# EasyEDA schematic RC_Car_Project_Slave.json
TITLE: RC Car Project SLAVE; REV: 1.0; Date: 2022-10-08; Sheet: 1/1; Drawn By: Hugo MATHIEU; Company: BUT R&T, Aix-Marseille Université
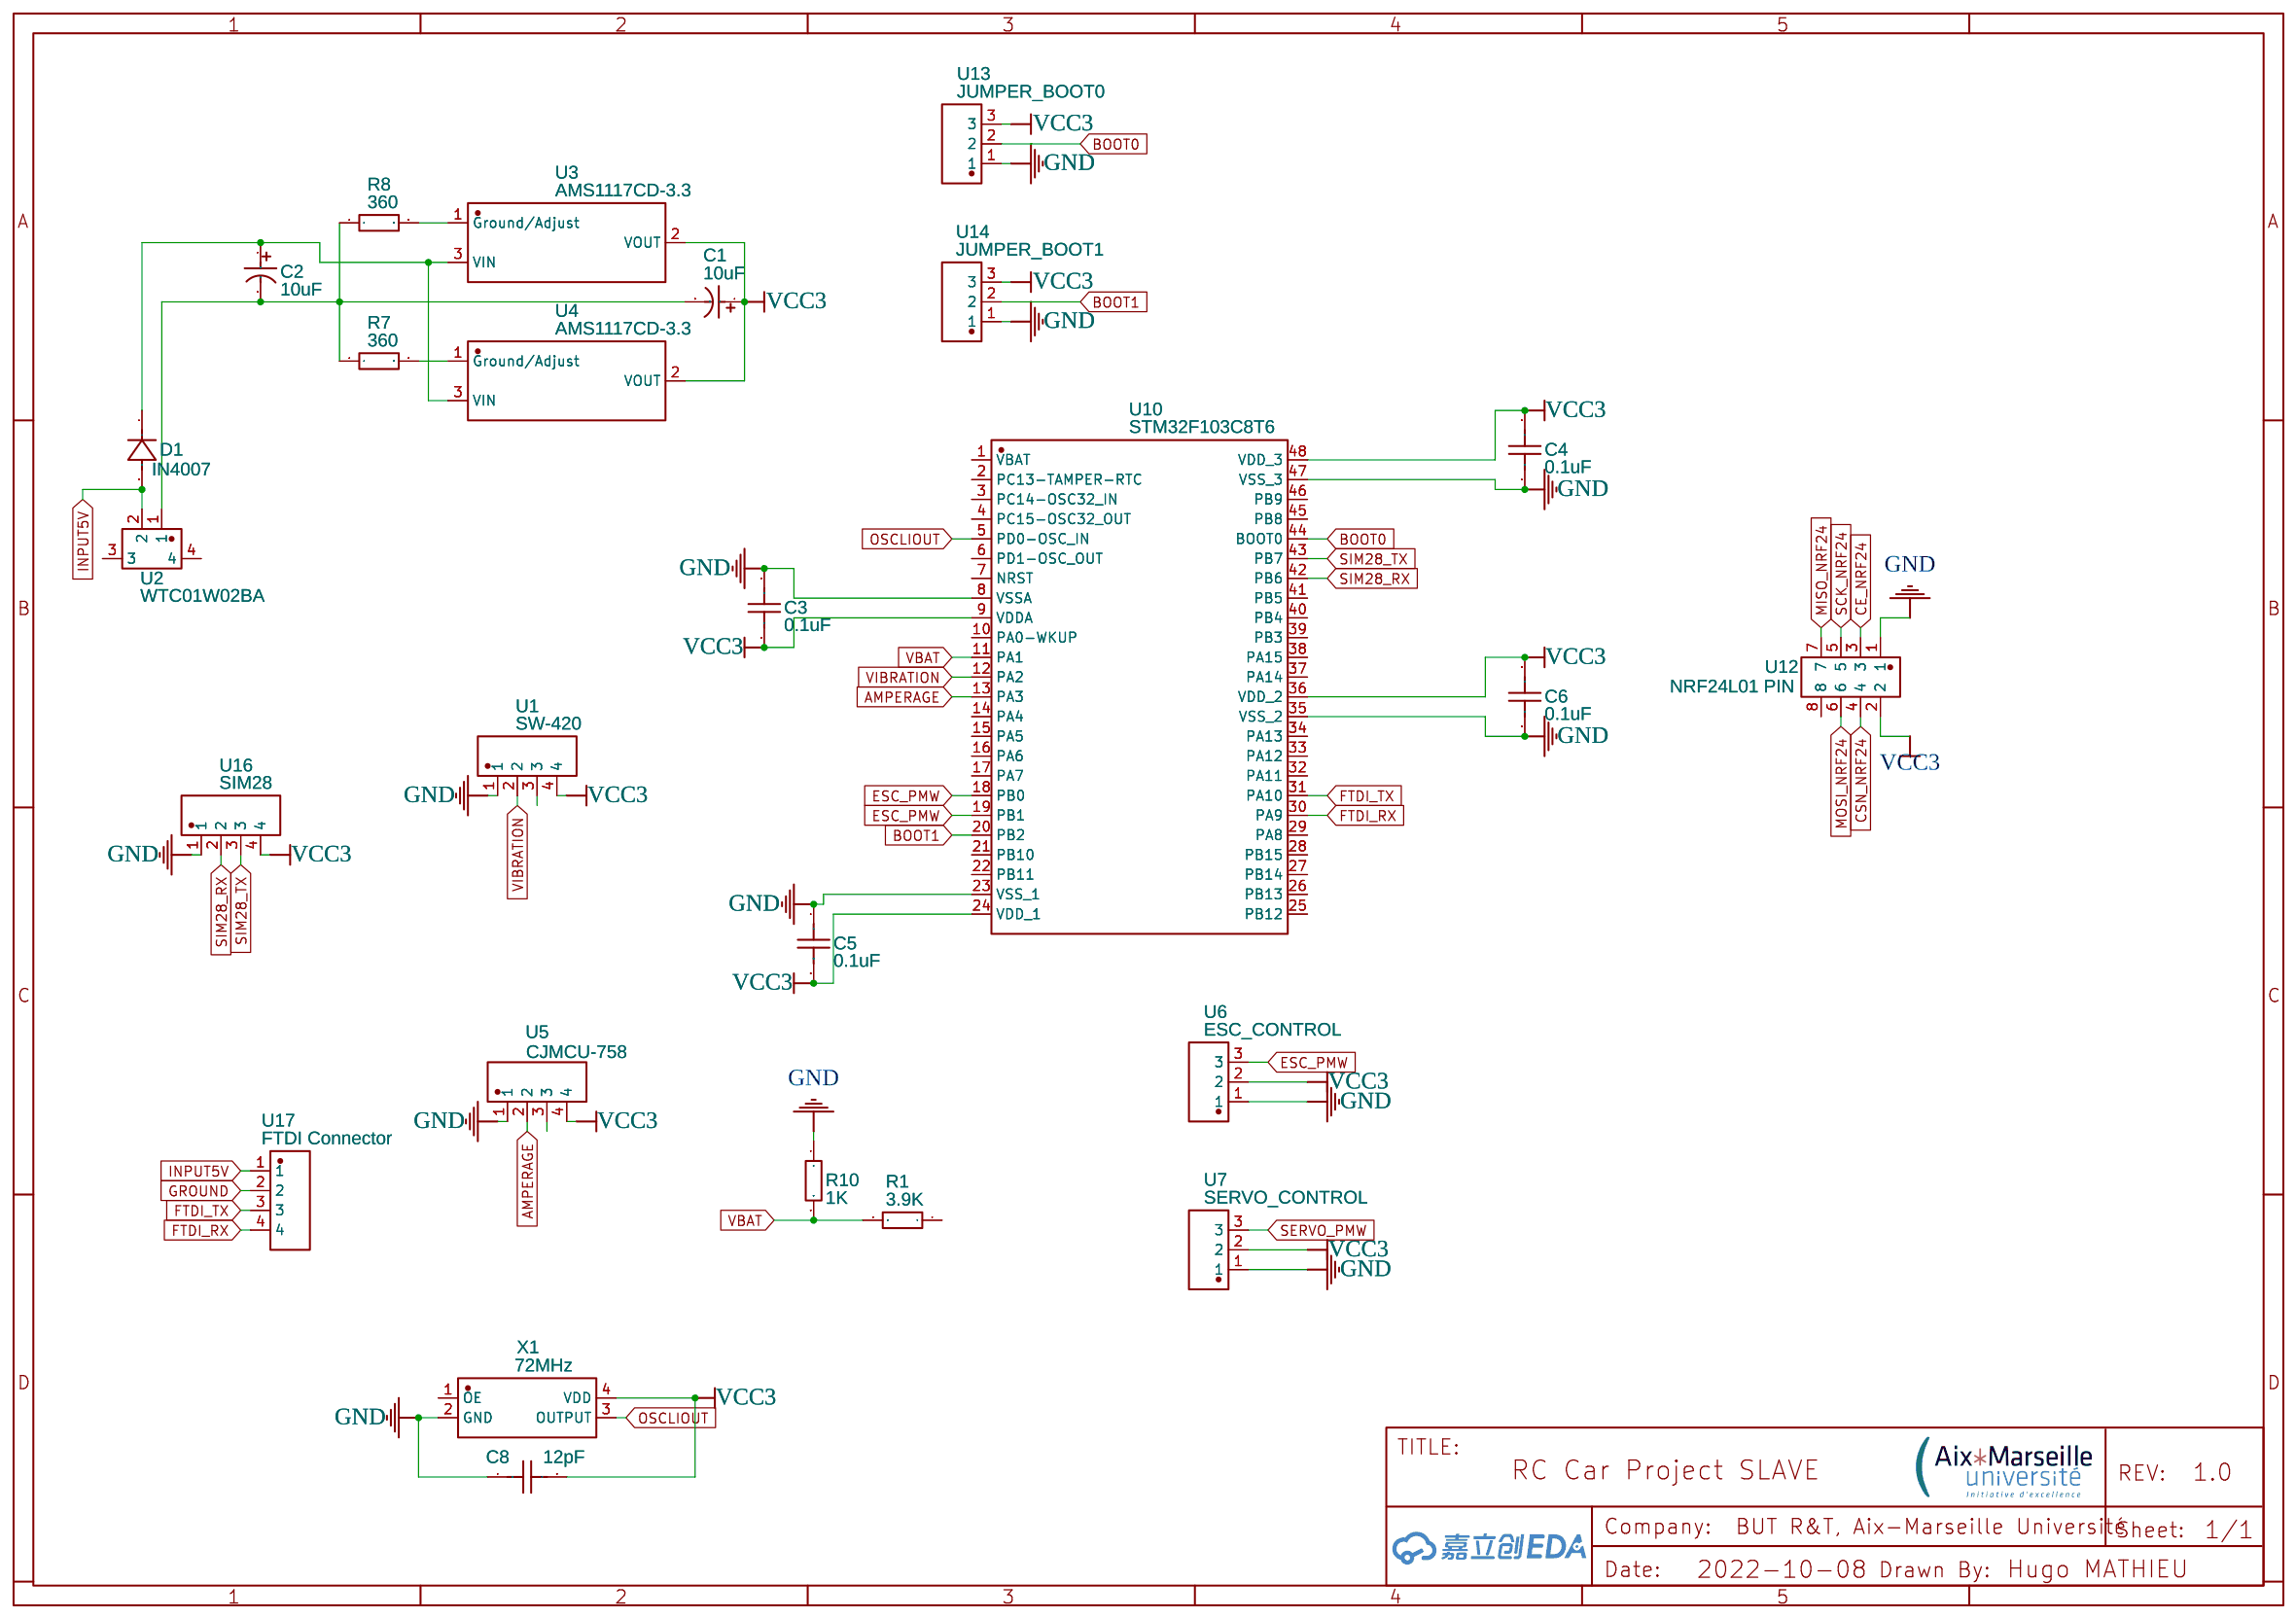
[diagram p0: schematic sheet]

## Parts
C1  10uF  [CAP-SMD_BD5.0-L5.3-W5.3-FD]
C2  10uF  [CAP-SMD_BD5.0-L5.3-W5.3-FD]
C3  0.1uF  [C0805]
C4  0.1uF  [C0805]
C5  0.1uF  [C0805]
C6  0.1uF  [C0805]
C8  12pF  [C0805]
D1  IN4007  [SMA_L4.3-W2.6-LS5.1-RD]
R1  3.9K  [R0805]
R7  360  [R0805]
R8  360  [R0805]
R10  1K  [R0805]
U1  SW-420  [HDR-TH_4P-P2.54-V-M-1]
U2  WTC01W02BA  [CONN-SMD_2P-P1.25_BZCN_WTC01W02BA]
U3  AMS1117CD-3.3  [TO-252-2_L6.6-W6.1-P4.57-LS9.9-BR-CW]
U4  AMS1117CD-3.3  [TO-252-2_L6.6-W6.1-P4.57-LS9.9-BR-CW]
U5  CJMCU-758  [HDR-TH_4P-P2.54-V-M-1]
U6  ESC_CONTROL  [HDR-TH_3P-P2.54-V-M-1]
U7  SERVO_CONTROL  [HDR-TH_3P-P2.54-V-M-1]
U10  STM32F103C8T6  [LQFP-48_L7.0-W7.0-P0.50-LS9.0-BL]
U12  NRF24L01 PIN  [HDR-TH_8P-P2.54-V-F-R2-C4-S2.54]
U13  JUMPER_BOOT0  [HDR-TH_3P-P2.54-V-M-1]
U14  JUMPER_BOOT1  [HDR-TH_3P-P2.54-V-M-1]
U16  SIM28  [HDR-TH_4P-P2.54-V-M-1]
U17  FTDI Connector  [HDR-TH_4P-P2.54-V-M-1]
X1  72MHz  [OSC-SMD_4P-L5.0-W3.2-BL_SG5032]

## Library data of the parts
C1 C2 = RVT1H100M0505: Supplier: LCSC; Manufacturer: ROQANG; Supplier Part: C72487; JLCPCB Part Class: Extended Part
C3-C6 C8 = AC0805JRNPO9BN220: Supplier: LCSC; Supplier Part: C149614; Manufacturer: YAGEO; Contributor: LCSC; JLCPCB Part Class: Extended Part
D1 = IN4007: Supplier: LCSC; Supplier Part: C9900004719; JLCPCB Part Class: Extended Part; Contributor: LCSC
R1 R7 R8 R10 = RC0805FR-07100RL: Supplier: LCSC; Manufacturer: YAGEO; Supplier Part: C105577; JLCPCB Part Class: Extended Part; Resistance: 100Ω
U1 U5 U16 U17 = 2.54*4单排: Supplier: LCSC; Supplier Part: C9900016163; Manufacturer: null; JLCPCB Part Class: Extended Part; Contributor: lcsc
U2 = WTC01W02BA: Supplier: LCSC; Supplier Part: C5120226; Manufacturer: BZCN(博众电气); link: https://atta.szlcsc.com/upload/public/pdf/source/20220727/3388DBAC9C78C4D16ABF723F1601295B.pdf; Contributor: lcsc
U3 U4 = AMS1117CD-3.3: Supplier: LCSC; Supplier Part: C841796; Manufacturer: Advanced Monolithic Systems; Contributor: LCSC; JLCPCB Part Class: Extended Part
U6 U7 U13 U14 = 2.54*3单排: Supplier: LCSC; Supplier Part: C9900016162; Manufacturer: null; JLCPCB Part Class: Extended Part; Contributor: lcsc
U10 = STM32F103C8T6: Supplier: LCSC; Manufacturer: STMicroelectronics; Supplier Part: C8734; JLCPCB Part Class: Basic Part
U12 = 2.54-2*4: Supplier: LCSC; Supplier Part: C2977588; Manufacturer: ZHOURI(洲日); link: https://atta.szlcsc.com/upload/public/pdf/source/20220328/363EB391BC0EB759CF231FC910753CBE.pdf; Contributor: LCSC
X1 = S5D13.560000A20F30T: Supplier: LCSC; Supplier Part: C387226; Manufacturer: Shenzhen SCTF Elec; Contributor: LCSC; JLCPCB Part Class: Extended Part

## Nets
GND: C3.1 C4.1 C5.1 C6.1 C8.1 R10.1 U1.1 U5.1 U6.1 U7.1 U10.8(VSSA) U10.23(VSS_1) U10.35(VSS_2) U10.47(VSS_3) U12.1 U13.1 U14.1 U16.1 X1.2(GND)
VBAT: R1.2 R10.2 U10.11(PA1)
VCC3: C1.1 C3.2 C4.2 C5.2 C6.2 C8.2 U1.4 U3.2(VOUT) U4.2(VOUT) U5.4 U6.2 U7.2 U10.9(VDDA) U10.24(VDD_1) U10.36(VDD_2) U10.48(VDD_3) U12.2 U13.3 U14.3 U16.4 X1.4(VDD)
AMPERAGE: U5.2 U10.13(PA3)
BOOT0: U10.44(BOOT0) U13.2
BOOT1: U10.20(PB2) U14.2
CE_NRF24: U12.3
CSN_NRF24: U12.4
ESC_PMW: U6.3 U10.18(PB0) U10.19(PB1)
FTDI_RX: U10.30(PA9) U17.4
FTDI_TX: U10.31(PA10) U17.3
GROUND: U17.2
INPUT5V: D1.2(A) U2.2 U17.1
MISO_NRF24: U12.7
MOSI_NRF24: U12.6
OSCLIOUT: U10.5(PD0-OSC_IN) X1.3(OUTPUT)
SCK_NRF24: U12.5
SERVO_PMW: U7.3
SIM28_RX: U10.42(PB6) U16.2
SIM28_TX: U10.43(PB7) U16.3
VIBRATION: U1.2 U10.12(PA2)
Net-(C1-2): C1.2 C2.2 R7.1 R8.1 U2.1
Net-(C2-1): C2.1 D1.1(K) U3.3(VIN) U4.3(VIN)
Net-(R7-2): R7.2 U4.1(Ground/Adjust)
Net-(R8-2): R8.2 U3.1(Ground/Adjust)

Not connected (* = marked no-connect by the designer): R1 1; U1 3; U2 3 4; U5 3; U10 1(VBAT) 2(PC13-TAMPER-RTC) 3(PC14-OSC32_IN) 4(PC15-OSC32_OUT) 6(PD1-OSC_OUT) 7(NRST) 10(PA0-WKUP) 14(PA4) 15(PA5) 16(PA6) 17(PA7) 21(PB10) 22(PB11) 25(PB12) 26(PB13) 27(PB14) 28(PB15) 29(PA8) 32(PA11) 33(PA12) 34(PA13) 37(PA14) 38(PA15) 39(PB3) 40(PB4) 41(PB5) 45(PB8) 46(PB9); U12 8; X1 1(OE)
